# Altium schematic sheet USER_IO.SchDoc
size A4
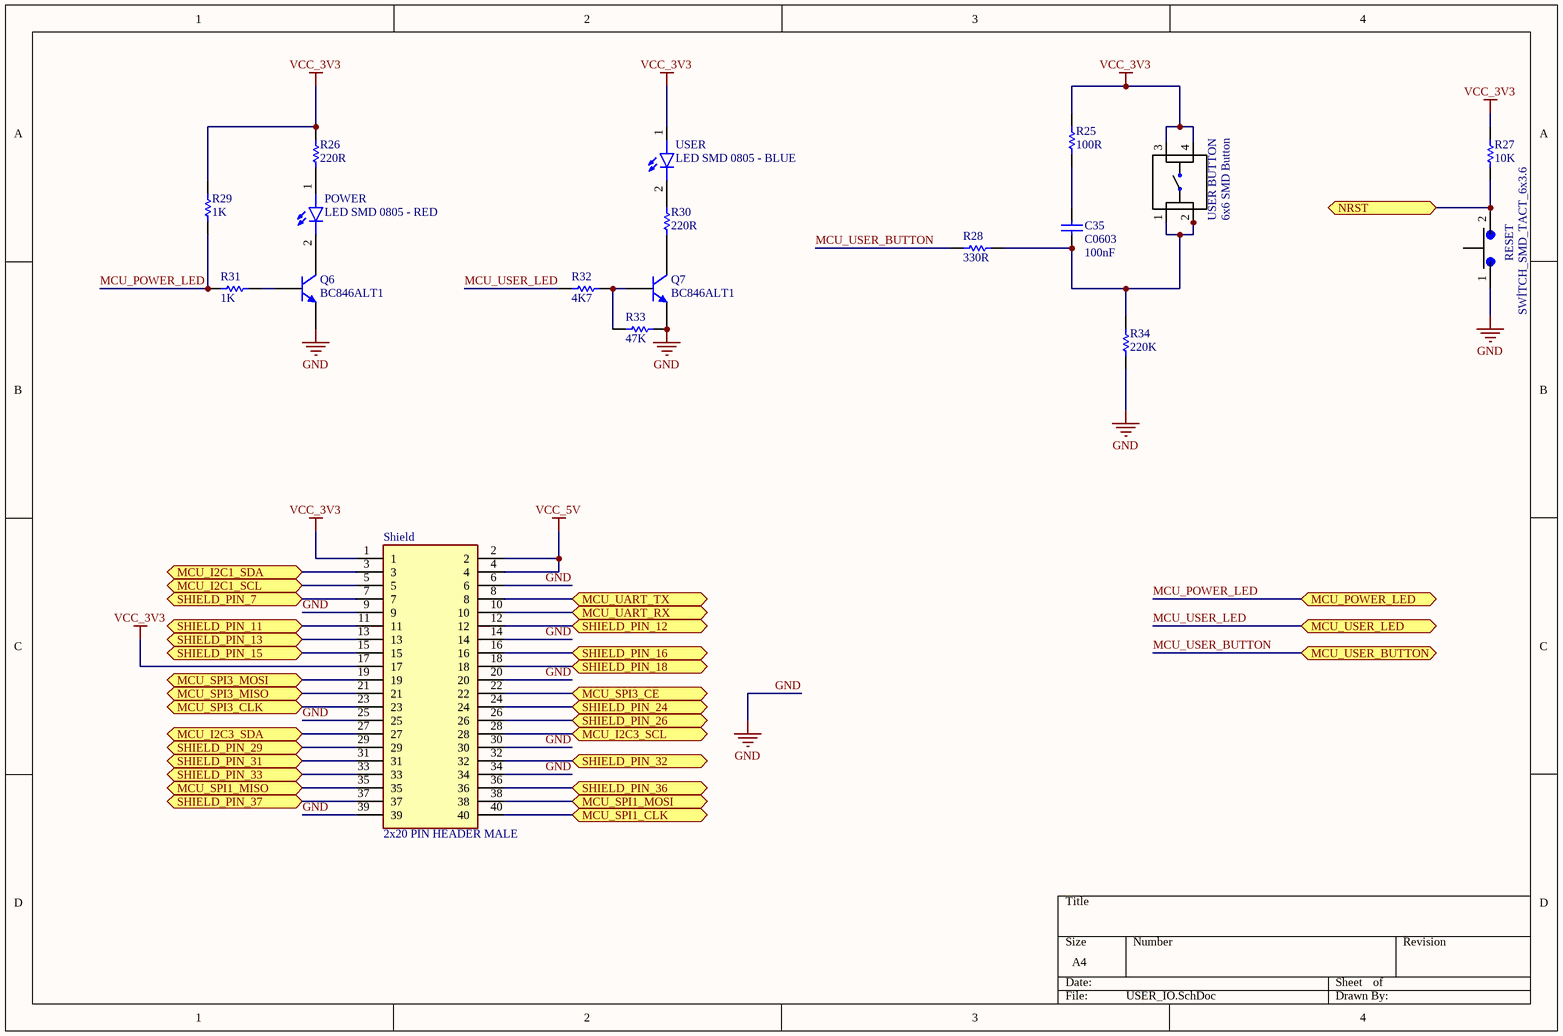
[diagram p0: USER_IO.SchDoc]

## Parts
C35  C0603  value 100nF  [C0603]
POWER  LED SMD 0805 - RED  [LED SMD 0805 - RED]
Q6  BC846ALT1  [BC846]
Q7  BC846ALT1  [BC846]
R25  value 100R  [CC1608-0603]  (hidden comment: Res0603)
R26  value 220R  [CC1608-0603]  (hidden comment: Res0603)
R27  value 10K  [CC1608-0603]  (hidden comment: Res0603)
R28  value 330R  [CC1608-0603]  (hidden comment: Res0603)
R29  value 1K  [CC1608-0603]  (hidden comment: Res0603)
R30  value 220R  [CC1608-0603]  (hidden comment: Res0603)
R31  value 1K  [CC1608-0603]  (hidden comment: Res0603)
R32  value 4K7  [CC1608-0603]  (hidden comment: Res0603)
R33  value 47K  [CC1608-0603]  (hidden comment: Res0603)
R34  value 220K  [CC1608-0603]  (hidden comment: Res0603)
RESET  SWİTCH_SMD_TACT_6x3.6  [SWİTCH_SMD_TACT_6X3.6]
Shield  2x20 PIN HEADER MALE  [2x20 PIN HEADER MALE]
USER  LED SMD 0805 - BLUE  [LED SMD 0805 - BLUE]
USER_BUTTON  6x6 SMD Button  [6x6 Smd Button]

## Ports
MCU_I2C1_SCL, MCU_I2C1_SDA, MCU_I2C3_SCL, MCU_I2C3_SDA, MCU_POWER_LED, MCU_SPI1_CLK, MCU_SPI1_MISO, MCU_SPI1_MOSI, MCU_SPI3_CE, MCU_SPI3_CLK, MCU_SPI3_MISO, MCU_SPI3_MOSI, MCU_UART_RX, MCU_UART_TX, MCU_USER_BUTTON, MCU_USER_LED, NRST, SHIELD_PIN_7, SHIELD_PIN_11, SHIELD_PIN_12, SHIELD_PIN_13, SHIELD_PIN_15, SHIELD_PIN_16, SHIELD_PIN_18, SHIELD_PIN_24, SHIELD_PIN_26, SHIELD_PIN_29, SHIELD_PIN_31, SHIELD_PIN_32, SHIELD_PIN_33, SHIELD_PIN_36, SHIELD_PIN_37

## Nets
GND: Q6.2(E) Q7.2(E) R33.1 R34.1 RESET.1 Shield.6 Shield.9 Shield.14 Shield.20 Shield.25 Shield.30 Shield.34 Shield.39
VCC_3V3: R25.1 R26.2 R27.1 R29.2 Shield.1 Shield.17 USER.1 USER_BUTTON.3 USER_BUTTON.4
VCC_5V: Shield.2 Shield.4
MCU_I2C1_SCL: Shield.5 ; port MCU_I2C1_SCL
MCU_I2C1_SDA: Shield.3 ; port MCU_I2C1_SDA
MCU_I2C3_SCL: Shield.28 ; port MCU_I2C3_SCL
MCU_I2C3_SDA: Shield.27 ; port MCU_I2C3_SDA
MCU_POWER_LED: R29.1 R31.2 ; port MCU_POWER_LED
MCU_SPI1_CLK: Shield.40 ; port MCU_SPI1_CLK
MCU_SPI1_MISO: Shield.35 ; port MCU_SPI1_MISO
MCU_SPI1_MOSI: Shield.38 ; port MCU_SPI1_MOSI
MCU_SPI3_CE: Shield.22 ; port MCU_SPI3_CE
MCU_SPI3_CLK: Shield.23 ; port MCU_SPI3_CLK
MCU_SPI3_MISO: Shield.21 ; port MCU_SPI3_MISO
MCU_SPI3_MOSI: Shield.19 ; port MCU_SPI3_MOSI
MCU_UART_RX: Shield.10 ; port MCU_UART_RX
MCU_UART_TX: Shield.8 ; port MCU_UART_TX
MCU_USER_BUTTON: R28.2 ; port MCU_USER_BUTTON
MCU_USER_LED: R32.2 ; port MCU_USER_LED
NRST: R27.2 RESET.2 ; port NRST
SHIELD_PIN_7: Shield.7 ; port SHIELD_PIN_7
SHIELD_PIN_11: Shield.11 ; port SHIELD_PIN_11
SHIELD_PIN_12: Shield.12 ; port SHIELD_PIN_12
SHIELD_PIN_13: Shield.13 ; port SHIELD_PIN_13
SHIELD_PIN_15: Shield.15 ; port SHIELD_PIN_15
SHIELD_PIN_16: Shield.16 ; port SHIELD_PIN_16
SHIELD_PIN_18: Shield.18 ; port SHIELD_PIN_18
SHIELD_PIN_24: Shield.24 ; port SHIELD_PIN_24
SHIELD_PIN_26: Shield.26 ; port SHIELD_PIN_26
SHIELD_PIN_29: Shield.29 ; port SHIELD_PIN_29
SHIELD_PIN_31: Shield.31 ; port SHIELD_PIN_31
SHIELD_PIN_32: Shield.32 ; port SHIELD_PIN_32
SHIELD_PIN_33: Shield.33 ; port SHIELD_PIN_33
SHIELD_PIN_36: Shield.36 ; port SHIELD_PIN_36
SHIELD_PIN_37: Shield.37 ; port SHIELD_PIN_37
NetC35_1: C35.1 R28.1 R34.2 USER_BUTTON.1 USER_BUTTON.2
NetC35_2: C35.2 R25.2
NetPOWER_1: POWER.1 R26.1
NetPOWER_2: POWER.2 Q6.3(C)
NetQ6_1: Q6.1(B) R31.1
NetQ7_1: Q7.1(B) R32.1 R33.2
NetQ7_3: Q7.3(C) R30.2
NetR30_1: R30.1 USER.2

## Library data of the parts
C35 = C0603: Ceramic Chip Capacitor - Standard; Note: Footprint corresponds to dimensions for bulk cassette packaging. This case size has tightened tolerances.; Published: 17-Jul-2002; LatestRevisionDate: 19-Mar-2004; LatestRevisionNote: Silkscreen size reduced.; DatasheetDocument: Mar-2001; PackageDocument: Mar-2001; PackageReference: 0603; Publisher: Altium Limited; Code_JEITA: 0603; Code_IPC: 1608 [0603]; ComponentLink1Description: Manufacturer Link; ComponentLink1URL: http://www.kemet.com/; ComponentLink2Description: Datasheet; ComponentLink2URL: http://www.kemet.com/kemet/web/homepage/kechome.nsf/vapubfilesname/F3102TA.pdf/$file/F3102TA.pdf
Q6 Q7 = BC846ALT1: General Purpose Transistor NPN Silicon; Published: 29-Sep-2000; LatestRevisionDate: 17-Jul-2002; LatestRevisionNote: Re-released for DXP Platform.; DatasheetVersion: 1997; PackageVersion: 1997; PackageReference: 318-08; Publisher: Altium Limited; PackageDescription: SOT-23; 3 Leads; Body 3.0 x 2.6 mm, inc. leads (LxW max); ComponentLink1Description: Manufacturer Link; ComponentLink1URL: http://www.onsemi.com/site/products/landing?taxonomyID=194; ComponentLink2Description: Datasheet; ComponentLink2URL: http://www.onsemi.com/pub/Collateral/BC846ALT1-D.PDF
R25-R34 = Res0603: Resistor; Manufacturer: Generic Components; Class I: Passive; Published: 8-Jun-2000; Revision: July-2002: Re-released for DXP Platform.; Publisher: Altium Limited; Class II: Resistor